# EAGLE design esp32_LedTube (EAGLE 9.6.2)
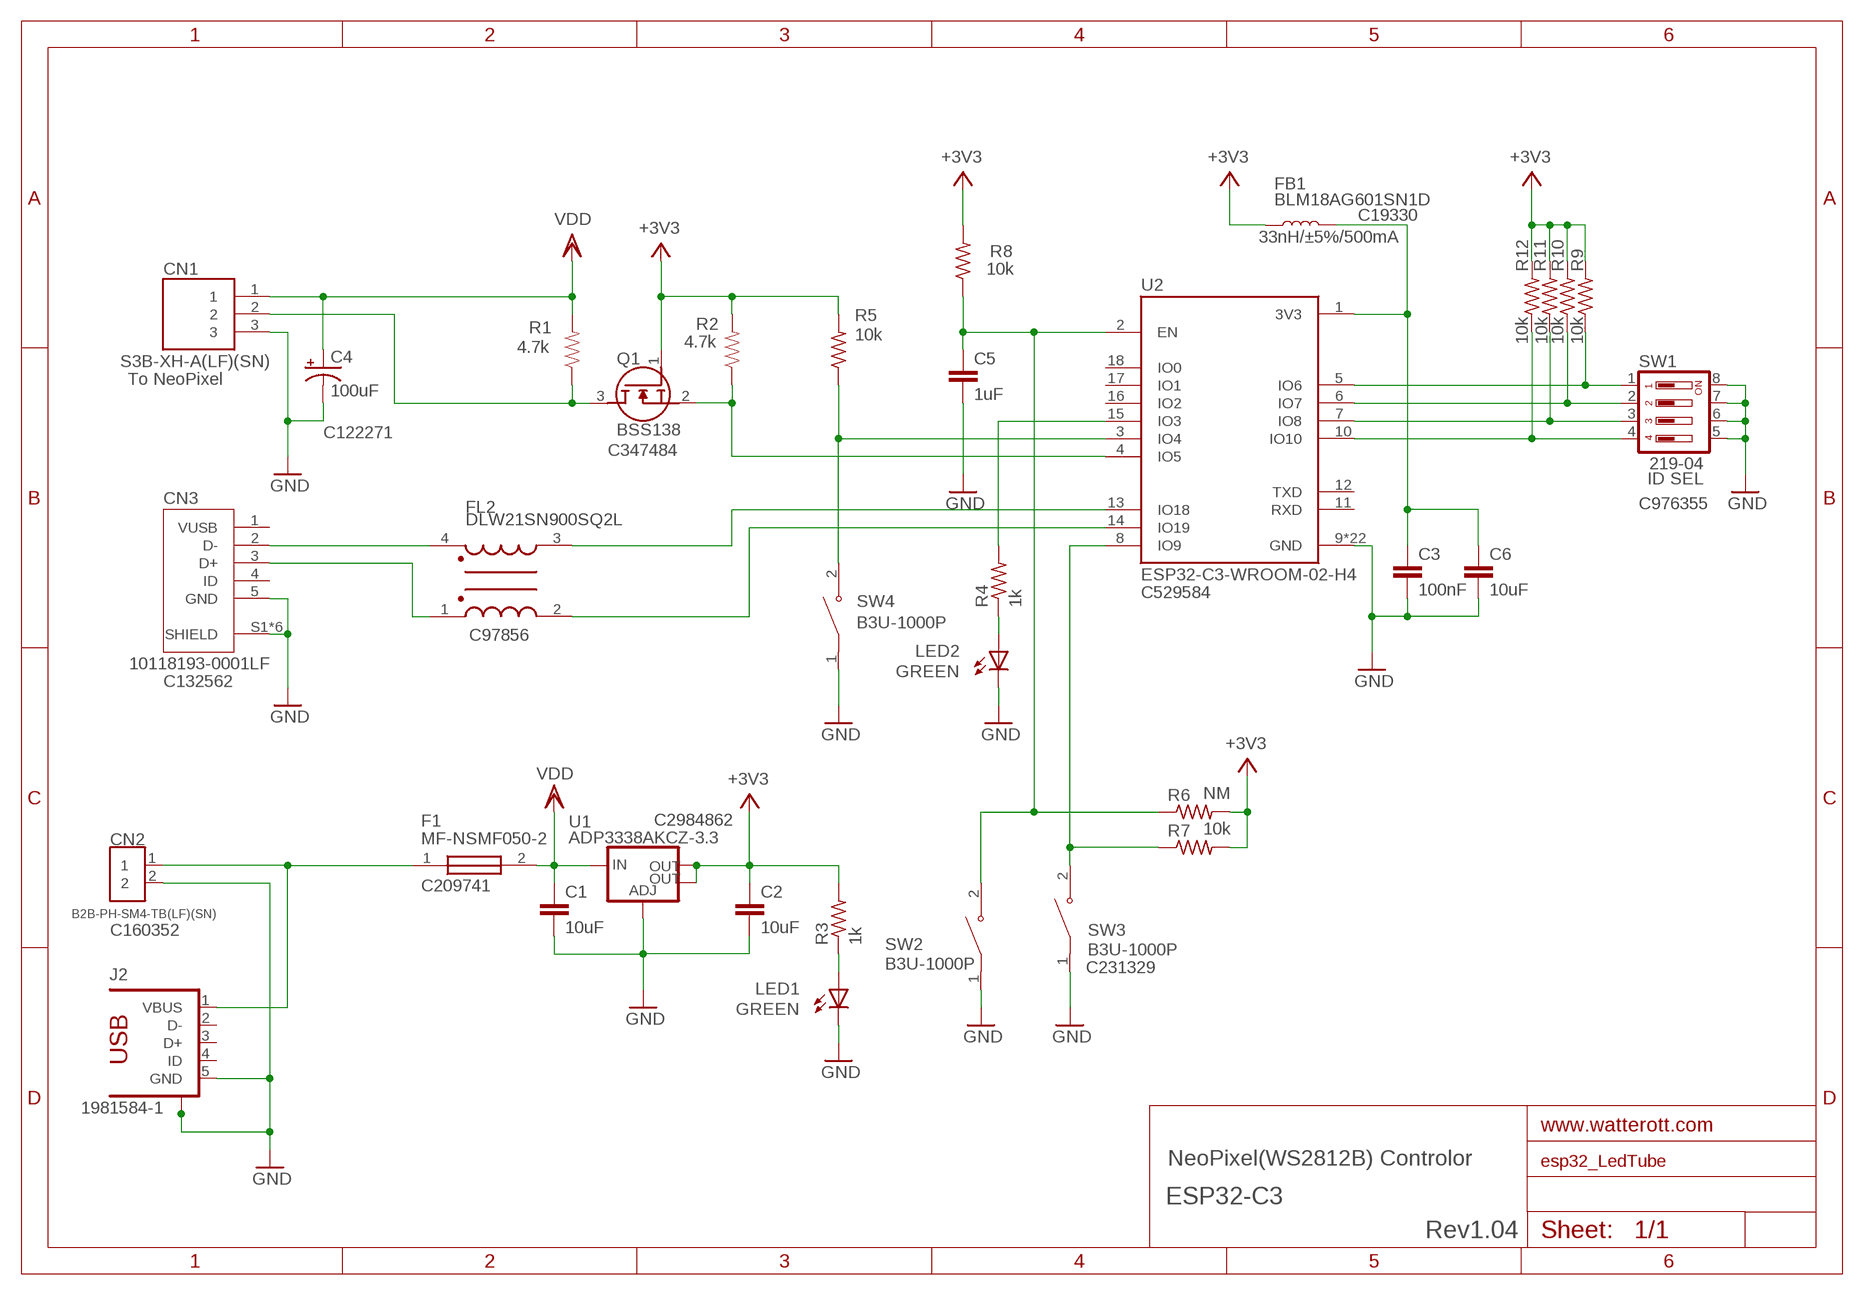
[diagram p0: schematic, sheet 1]

## Parts
C1  10uF  C-EUC0603  [C0603]
C2  10uF  C-EUC0603  [C0603]
C3  100nF  C-EUC0603  [C0603]
C4  100uF  CPOL-USB/3528-21R  [B/3528-21R]
C5  1uF  C-EUC0603  [C0603]
C6  10uF  C-EUC0603  [C0603]
CN1  S3B-XH-A(LF)(SN)  [JST_S3B-XH-A(LF)(SN)]
CN2  B2B-PH-SM4-TB(LF)(SN)  [JST_B2B-PH-SM4-TB(LF)(SN)]
CN3  10118193-0001LF  [FCI_10118193-0001LF]
F1  MF-NSMF050-2  [FUSC3216X85N]
FB1  33nH/±5%/500mA  INDUCTOR-0603-33NH  [0603]
FL2  DLW21SN900SQ2L  [FIL_DLW21SN900SQ2L]
J2  1981584-1  [1981584-1]
LED1  GREEN  LEDCHIPLED_0603  [CHIPLED_0603]
LED2  GREEN  LEDCHIPLED_0603  [CHIPLED_0603]
Q1  BSS138  [SOT95P240X120-3N]
R1  4.7k  750OHM-0603-1/10W-1%  [0603]
R2  4.7k  750OHM-0603-1/10W-1%  [0603]
R3  1k  R-US_R0603  [R0603]
R4  1k  R-US_R0603  [R0603]
R5  10k  R-US_R0603  [R0603]
R6  NM  R-US_R0603  [R0603]
R7  10k  R-US_R0603  [R0603]
R8  10k  R-US_R0603  [R0603]
R9  10k  R-US_R0603  [R0603]
R10  10k  R-US_R0603  [R0603]
R11  10k  R-US_R0603  [R0603]
R12  10k  R-US_R0603  [R0603]
SW1  219-04  [CTS-219-04]
SW2  B3U-1000P  [SW_B3U-1000P]
SW3  B3U-1000P  [SW_B3U-1000P]
SW4  B3U-1000P  [SW_B3U-1000P]
U1  ADP3338AKCZ-3.3  V_REG_LM1117SOT223  [SOT223]
U2  ESP32-C3-WROOM-02-H4  [MODULE_ESP32-C3-WROOM-02-H4]

## Nets
+3V3 [Power]: C2.1 FB1.1 Q1.1(G) R2.2 R3.2 R5.2 R6.2 R7.2 R8.2 R9.2 R10.2 R11.2 R12.2 U1.2(OUT) U1.4(OUT)
GND: C1.2 C2.2 C3.2 C4.- C5.2 C6.2 CN1.3 CN2.2 CN3.5(GND) CN3.S1(SHIELD) CN3.S2(SHIELD) CN3.S3(SHIELD) CN3.S4(SHIELD) CN3.S5(SHIELD) CN3.S6(SHIELD) J2.5(GND) J2.S1 J2.S2 J2.S3 J2.S4 LED1.C LED2.C SW1.5 SW1.6 SW1.7 SW1.8 SW2.1 SW3.1 SW4.1 U1.1(ADJ) U2.9(GND) U2.19(GND) U2.20(GND) U2.21(GND) U2.22(GND) U2.23(GND) U2.24(GND) U2.25(GND) U2.26(GND) U2.27(GND) U2.28(GND) U2.29(GND) U2.30(GND) U2.31(GND) U2.32(GND) U2.33(GND) U2.34(GND) U2.35(GND) U2.36(GND) U2.37(GND) U2.38(GND) U2.39(GND)
IO4: R9.1 SW1.1 U2.5(IO6)
IO12: R10.1 SW1.2 U2.6(IO7)
IO13: R11.1 SW1.3 U2.7(IO8)
IO14: R12.1 SW1.4 U2.10(IO10)
N$1: CN1.2 Q1.3(D) R1.1
N$2: LED2.A R4.1
N$3: FL2.3 U2.13(IO18)
N$4: R5.1 SW4.2 U2.3(IO4)
N$5: CN2.1 F1.1 J2.1(VBUS)
N$6: CN3.2(D-) FL2.4
N$8: CN3.3(D+) FL2.1
N$10: FL2.2 U2.14(IO19)
N$13: R4.2 U2.15(IO3)
N$15: LED1.A R3.1
N$17: R7.1 SW3.2 U2.8(IO9)
N$23: C3.1 C6.1 FB1.2 U2.1(3V3)
RST: C5.1 R6.1 R8.1 SW2.2 U2.2(EN)
SCL_18: Q1.2(S) R2.1 U2.4(IO5)
VDD: C1.1 C4.+ CN1.1 F1.2 R1.2 U1.3(IN)
Unconnected: CN3.1(VUSB) CN3.4(ID) J2.2(D-) J2.3(D+) J2.4(ID) U2.11(RXD) U2.12(TXD) U2.16(IO2) U2.17(IO1) U2.18(IO0)

## Notes on the sheet
- BLM18AG601SN1D
- C19330
- To NeoPixel
- C122271
- C347484
- ID SEL
- C976355
- C529584
- C97856
- C132562
- C2984862
- C209741
- C160352
- C231329
- NeoPixel(WS2812B) Controlor
- ESP32-C3
- Rev1.04

## Library data of the parts
C1-C3 C5 C6 = resistor:C-EU: CAPACITOR, European symbol
C4 = rcl:CPOL-US: POLARIZED CAPACITOR, American symbol; SPICEPREFIX: C
CN1 = S3B-XH-A_LF__SN_:S3B-XH-A(LF)(SN): Connector Header Through Hole, Right Angle 3 position 0.098" (2.50mm) Check availability <https://pricing.snapeda.com/parts/S3B-XH-A%20%28LF%29%28SN%29/JST/view-part?ref=eda>; AVAILABILITY: In Stock; DESCRIPTION: CONN, R/A HEADER, 3POS, 1ROW, 2.5MM; Connector Systems:Wire-to-Board; Pitch Spacing:2.5mm; No. of Rows:1Rows; No. of Contacts:3Contacts; Contact Termination Type:Through Hole Right Angle; Product Range:XH Series RoHS Compliant: Yes; MF: JST; MP: S3B-XH-A (LF)(SN); PACKAGE: None; PRICE: None; PURCHASE-URL: https://pricing.snapeda.com/search/part/S3B-XH-A (LF)(SN)/?ref=eda
CN2 = B2B-PH-SM4-TB_LF__SN_:B2B-PH-SM4-TB(LF)(SN): PH Series 2 Position 2 mm Pitch Surface Mount Top Entry Shrouded Header; DESCRIPTION: Connector Header Surface Mount 2 position 0.079 _2.00mm_; DIGI-KEY_PART_NUMBER: 455-1734-1-ND; DIGI-KEY_PURCHASE_URL: https://www.digikey.jp/product-detail/en/jst-sales-america-inc/B2B-PH-SM4-TB_LF__SN_/455-1734-1-ND/926831?utm_source=snapeda&utm_medium=aggregator&utm_campaign=symbol; MF: JST Sales; MP: B2B-PH-SM4-TB_LF__SN_; PACKAGE: None
CN3 = 10118193-0001LF:10118193-0001LF: Micro USB B Type Receptacle Check availability <https://pricing.snapeda.com/parts/10118193-0001LF/FCI/view-part?ref=eda>; AVAILABILITY: In Stock; DESCRIPTION: USB - micro B USB 2.0 Receptacle Connector 5 Position Surface Mount, Right Angle; Through Hole; MF: FCI; MP: 10118193-0001LF; PACKAGE: None; PRICE: None
F1 = MF-NSMF050-2:MF-NSMF050-2: Bourns 0.5A Surface Mount Resettable Fuse, 13.2V Source: Datasheet <https://componentsearchengine.com/Datasheets/2/MF-NSMF050-2.pdf>; DESCRIPTION: Bourns 0.5A Surface Mount Resettable Fuse, 13.2V; HEIGHT: 0.85mm; MANUFACTURER_NAME: Bourns; MANUFACTURER_PART_NUMBER: MF-NSMF050-2; MOUSER_PART_NUMBER: 652-MF-NSMF050-2; MOUSER_PRICE-STOCK: https://www.mouser.co.uk/ProductDetail/Bourns/MF-NSMF050-2?qs=sp2SQcijSb%252B%2FRFTS0mqFfg%3D%3D
FB1 = SparkFun-Coils:INDUCTOR: Inductors Resist changes in electrical current. Basically a coil of wire. SparkFun Products: SparkFun Load Cell Amplifier - HX711 <https://www.sparkfun.com/products/13879> IOIO-OTG - V2.2 <https://www.sparkfun.com/products/13613>; PROD_ID: NDUC-07874
FL2 = DLW21SN900SQ2L:DLW21SN900SQ2L: Check availability <https://pricing.snapeda.com/parts/DLW21SN900SQ2L/Murata/view-part?ref=eda>; AVAILABILITY: In Stock; DESCRIPTION: 2 Line Common Mode Choke Surface Mount 90 Ohms @ 100 MHz 330mA DCR 350mOhm; MF: Murata; MP: DLW21SN900SQ2L; PACKAGE: Horizontal-4 Murata; PRICE: None; PURCHASE-URL: https://pricing.snapeda.com/search/part/DLW21SN900SQ2L/?ref=eda
J2 = con-usb:1981584-1: Receptacle, micro-USB, type A/B Tyco Electronics; MF: Hirose; MPN: ZX62-AB-5PA(11)
LED1 LED2 = adafruit:LED: LED OSRAM: - CHIPLED LG R971, LG N971, LY N971, LG Q971, LY Q971, LO R971, LY R971 LH N974, LH R974 LS Q976, LO Q976, LY Q976 LO Q996 - Hyper CHIPLED LW Q18S LB Q993, LB Q99A, LB R99A - SideLED LS A670, LO A670, LY A670, LG A670, LP A670 LB A673, LV A673, LT A673, LW A673 LH A674 LY A675 LS A676, LA A676, LO A676, LY A676, LW A676 LS A679, LY A679, LG A679 - Hyper Micro SIDELED® LS Y876, LA Y876, LO Y876, LY Y876 LT Y87S - SmartLED LW L88C, LW L88S LB L89C, LB L89S, LG L890 LS L89K, LO L89K, LY L89K LS L896, LA L896, LO L896, LY L896 - TOPLED LS T670, LO T670, LY T670, LG T670, LP T670 LSG T670, LSP T670, LSY T670, LOP T670, LYG T670 LG T671, LOG T671, LSG T671 LB T673, LV T673, LT T673, LW T673 LH T674 LS T676, LA T676, LO T676, LY T676, LB T676, LH T676, LSB T676, LW T676 LB T67C, LV T67C, LT T67C, LS T67K, LO T67K, LY T67K, LW E67C LS E67B, LA E67B, LO E67B, LY E67B, LB E67C, LV E67C, LT E67C LW T67C LS T679, LY T679, LG T679 LS T770, LO T770, LY T770, LG T770, LP T770 LB T773, LV T773, LT T773, LW T773 LH T774 LS E675, LA E675, LY E675, LS T675 LS T776, LA T776, LO T776, LY T776, LB T776 LHGB T686 LT T68C, LB T68C - Hyper Mini TOPLED® LB M676 - Mini TOPLED Santana® LG M470 LS M47K, LO M47K, LY M47K Source: http://www.osram.convergy.de/
Q1 = SamacSys_Parts:BSS138: N-channel MOSFET,BSS138 0.2A 50V Source: Datasheet <https://www.onsemi.com/pub/Collateral/BSS138-D.PDF>; DESCRIPTION: N-channel MOSFET,BSS138 0.2A 50V; HEIGHT: 1.2mm; MANUFACTURER_NAME: ON Semiconductor; MANUFACTURER_PART_NUMBER: BSS138; MOUSER_PART_NUMBER: 512-BSS138; MOUSER_PRICE-STOCK: https://www.mouser.co.uk/ProductDetail/ON-Semiconductor-Fairchild/BSS138?qs=HK%252BeIG1iaahCeqBvjB4arg%3D%3D
R1 R2 = SparkFun-Resistors:750OHM: 750Ω resistor A resistor is a passive two-terminal electrical component that implements electrical resistance as a circuit element. Resistors act to reduce current flow, and, at the same time, act to lower voltage levels within circuits. - Wikipedia; PROD_ID: RES-07824; VALUE: 750
R3-R12 = resistor:R-US_: RESISTOR, American symbol
SW1 = switch-dil:219-04*: Surface Mount DIP Switch Series 219 SMT CTS Electronic Components Sourc: www.ctscorp.com; OC_FARNELL: unknown; OC_NEWARK: unknown
SW2-SW4 = B3U-1000P:B3U-1000P: Switch Tactile N.O. SPST Round Button Gull Wing 0.05A 12VDC 1.5N SMD Embossed T/R Check prices <https://pricing.snapeda.com/parts/B3U-1000P/Omron/view-part?ref=eda>; AVAILABILITY: In Stock; DESCRIPTION: Tactile Switch SPST-NO Top Actuated Surface Mount; MF: Omron; MP: B3U-1000P; PACKAGE: Custom Package Omron; PRICE: None; PURCHASE-URL: https://pricing.snapeda.com/search/part/B3U-1000P/?ref=eda
U1 = SparkFun-PowerIC:V_REG_LM1117: Voltage Regulator LM1117 Standard adjustable voltage regulator but in SMD form. Spark Fun Electronics SKU : COM-00595; PROD_ID: VREG-08170
U2 = ESP32-C3-WROOM-02-H4:ESP32-C3-WROOM-02-H4: WiFi Modules (802.11) (Engineering Samples) SMD module, ESP32-C3, 4MB SPI flash, PCB antenna, -40 C +105 C Check availability <https://pricing.snapeda.com/parts/ESP32-C3-WROOM-02-H4/Espressif%20Systems/view-part?ref=eda> Check availability <https://pricing.snapeda.com/parts/ESP32-C3-WROOM-02-H4/Espressif%20Systems/view-part?ref=eda> Check availability <https://pricing.snapeda.com/parts/ESP32-C3-WROOM-02-H4/Espressif%20Systems/view-part?ref=eda>; AVAILABILITY: In Stock; DESCRIPTION: WiFi Modules (802.11) (Engineering Samples) SMD module, ESP32-C3, 4MB SPI flash, PCB antenna, -40 C +105 C; MF: Espressif Systems; MP: ESP32-C3-WROOM-02-H4; PACKAGE: Package; PRICE: None; PURCHASE-URL: https://pricing.snapeda.com/search/part/ESP32-C3-WROOM-02-H4/?ref=eda

## Net classes
1 Power: width 0.305 mm

## Board
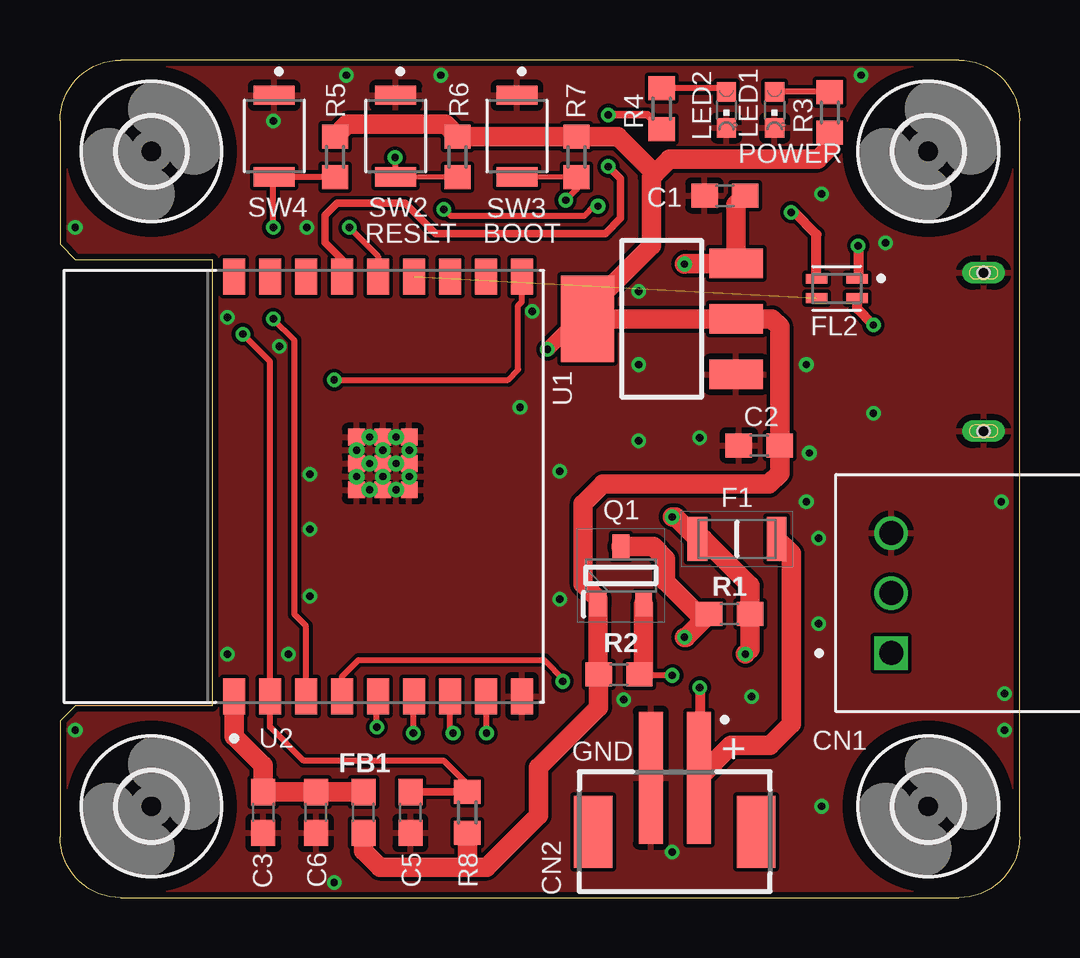
[diagram p1: board, top side]
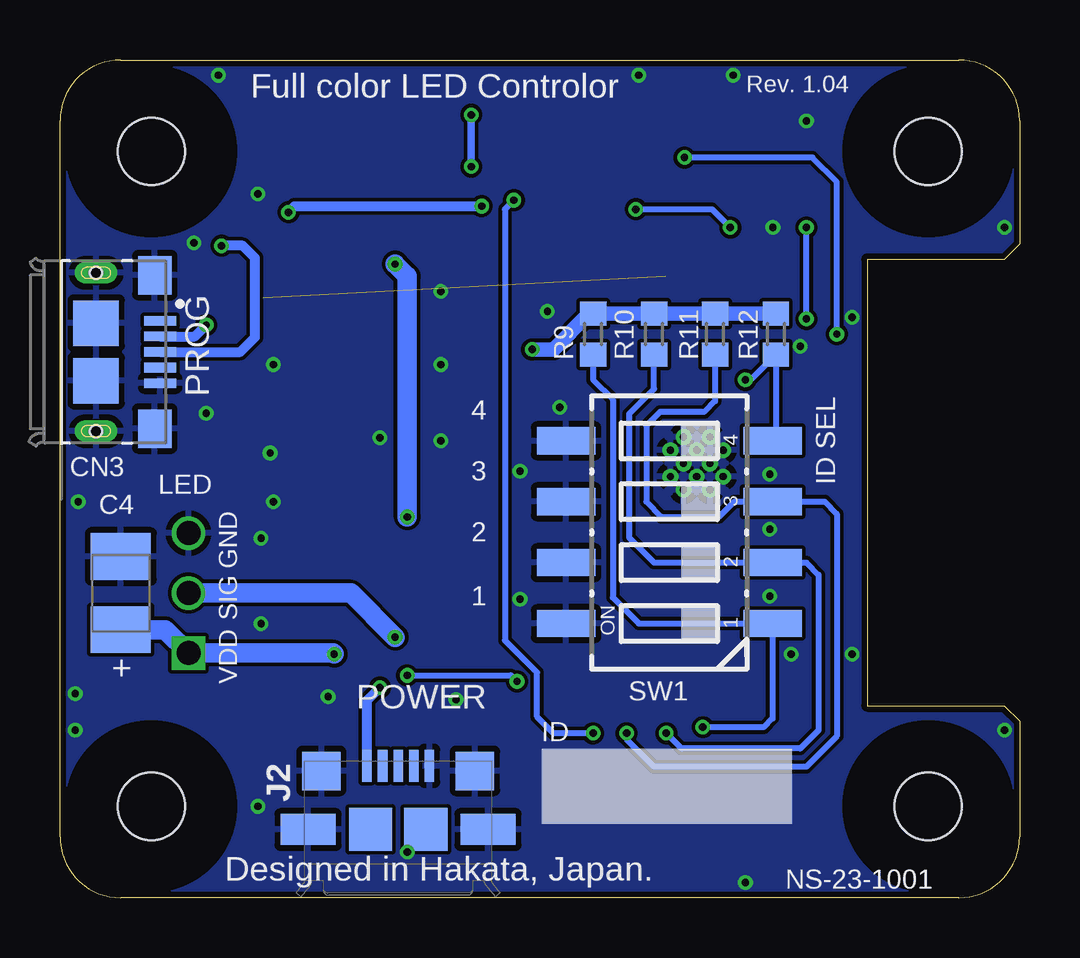
[diagram p2: board, bottom side, seen from below]

Size 40.01 x 34.92 mm. Coordinates in mm from the lower left corner, seen from the top.
Outline: 2.54,0 arc-90 0,2.54 0,7.37 0.64,8 6.35,8 6.35,26.61 0.64,26.61 0,27.24 0,32.38 arc-90 2.54,34.92 37.47,34.92 arc-90 40.01,32.38 40.01,2.54 arc-90 37.47,0 2.54,0
Copper layers (1*16): Top 0.035mm / dielectric 1.5mm / Bottom 0.035mm
Design rules "SeeedStudio_2layer_DRU_no_angle_20140221": minimum track width 6mil, minimum drill 12mil, track to track 6mil, track to pad 6mil, pad to pad 6mil, via to via 6mil, smd to smd 0mil, copper to edge 10mil, drill to drill 10mil, minimum pad ring 7mil, minimum via ring 6mil, stop-mask expansion 2mil, vias tented up to drill 100mil, thermal gap 10mil

### Footprints (pad centres in the part's own frame; a part is rotated, then mirrored left to right if it is on the bottom)
C0603 = smd 1.1 x 1: 1 -0.85,0; 2 0.85,0
B/3528-21R = smd 1.95 x 2.5: + 1.525,0; - -1.525,0
JST_S3B-XH-A(LF)(SN) = drill 1 square: 1 2.5,-3.45 | drill 1: 2 0,-3.45; 3 -2.5,-3.45
JST_B2B-PH-SM4-TB(LF)(SN) = smd 1 x 5.5: 1 -1,0; 2 1,0 | smd 1.6 x 3: 3 -3.4,2.25; 4 3.4,2.25
FCI_10118193-0001LF = smd 0.4 x 1.35: 1 -1.3,2.675; 2 -0.65,2.675; 3 0,2.675; 4 0.65,2.675; 5 1.3,2.675 | smd 1.6 x 1.4: S1 -3.2,2.45; S2 3.2,2.45 | smd 1.9 x 1.9: S3 1.2,0; S4 -1.2,0 | drill 0.5 pad 0.9 long: S5 -3.3,0; S6 3.3,0 | hole 0.5: -3.3,0; 3.3,0
FUSC3216X85N = smd 0.82 x 1.82: 1 -1.65,0; 2 1.65,0
0603 = smd 1.1 x 1: 1 -0.85,0; 2 0.85,0
FIL_DLW21SN900SQ2L = smd 0.9 x 0.4: 1 -0.85,-0.4; 2 0.85,-0.4; 3 0.85,0.4; 4 -0.85,0.4
1981584-1 = smd 0.4 x 1.35: 1 -1.3,4.1; 2 -0.65,4.1; 3 0,4.1; 4 0.65,4.1; 5 1.3,4.1 | smd 1.8 x 1.8: M1 -1.15,1.45; M2 1.15,1.45 | smd 2.3 x 1.3: S1 -3.75,1.45; S2 3.75,1.45 | smd 1.6 x 1.6: S3 -3.2,3.885; S4 3.2,3.885
CHIPLED_0603 = smd 0.8 x 0.8: A 0,-0.75; C 0,0.75
SOT95P240X120-3N = smd 1 x 0.7: 1 -1.2,0.95; 2 -1.2,-0.95; 3 1.2,0
R0603 = smd 1 x 1.1: 1 -0.85,0; 2 0.85,0
CTS-219-04 = smd 1.13 x 2.44: 1 -3.81,-4.3; 2 -1.27,-4.3; 3 1.27,-4.3; 4 3.81,-4.3; 5 3.81,4.3; 6 1.27,4.3; 7 -1.27,4.3; 8 -3.81,4.3
SW_B3U-1000P = smd 0.8 x 1.7: 1 -1.7,0; 2 1.7,0
SOT223 = smd 1.219 x 2.235: 1 -2.311,-3.099; 2 0,-3.099; 3 2.311,-3.099 | smd 3.6 x 2.2: 4 0,3.099
MODULE_ESP32-C3-WROOM-02-H4 = smd 1.5 x 0.9: 1 -8.75,2.9; 2 -8.75,1.4; 3 -8.75,-0.1; 4 -8.75,-1.6; 5 -8.75,-3.1; 6 -8.75,-4.6; 7 -8.75,-6.1; 8 -8.75,-7.6; 9 -8.75,-9.1; 10 8.75,-9.1; 11 8.75,-7.6; 12 8.75,-6.1; 13 8.75,-4.6; 14 8.75,-3.1; 15 8.75,-1.6; 16 8.75,-0.1; 17 8.75,1.4; 18 8.75,2.9 | smd 0.7 x 0.7: 19 -0.14,-2.2; 20 0.96,-2.2; 21 2.06,-2.2; 22 -0.14,-3.3; 23 0.96,-3.3; 24 2.06,-3.3; 25 -0.14,-4.4; 26 0.96,-4.4; 27 2.06,-4.4 | drill 0.3 pad 0.4: 28 0.41,-2.2; 29 1.51,-2.2; 30 -0.14,-2.75; 31 0.96,-2.75; 32 2.06,-2.75; 33 0.41,-3.3; 34 1.51,-3.3; 35 -0.14,-3.85; 36 0.96,-3.85; 37 2.06,-3.85; 38 0.41,-4.4; 39 1.51,-4.4
2,8 = hole 2.8: 0,0

### Placement (x,y rotation side)
C1  27.72,29.27 180 top
C2  29.15,18.86 180 top
C3  8.47,3.56 270 top
C4  37.47,12.7 270 bottom
C5  14.61,3.56 270 top
C6  10.67,3.56 270 top
CN1  38.1,12.7 270 top
CN2  25.63,5 180 top
CN3  38.5,22.75 270 bottom
F1  28.22,14.95 180 top
FB1  12.65,3.56 90 top
FL2  32.38,25.4 180 top
J2  25.91,1.4 0 bottom
LED1  29.79,32.84 180 top
LED2  27.78,32.84 180 top
Q1  23.38,13.44 90 top
R1  27.91,11.82 0 top
R2  23.3,9.31 180 top
R3  32.09,32.74 270 top
R4  25.08,32.89 270 top
R5  11.47,30.89 90 top
R6  16.57,30.89 90 top
R7  21.53,30.89 90 top
R8  16.98,3.56 270 top
R9  17.78,23.49 90 bottom
R10  15.24,23.49 90 bottom
R11  12.7,23.49 90 bottom
R12  10.16,23.49 90 bottom
SW1  14.61,15.24 90 bottom
SW2  14,31.75 270 top
SW3  19.05,31.75 270 top
SW4  8.93,31.75 270 top
U1  25.08,24.13 90 top
U2  10.16,17.14 90 top
U$1  [2,8]  3.81,31.11 0 top
U$2  [2,8]  36.2,31.11 0 top
U$3  [2,8]  3.81,3.81 0 top
U$4  [2,8]  36.2,3.81 0 top

### Tracks (layer width: path | path; a pad name or v marks a point on that pad's centre or on a via)
+3V3  (via drill 0.3)
  Top 0.61: v20.32,22.86 21.59,24.13 U1.4
  Top 0.813: 24.8,30.19 24.65,30.05 24.65,27.18 21.98,24.51 U1.4 U1.2 29.69,24.13 30,23.81 C2.1 | 24.8,30.19 25.4,30.8 31.59,30.8 32.09,31.29 R3.2 | 24.8,30.19 23.25,31.74 R7.2 R6.2 16.07,32.24 11.98,32.24 R5.2 | FB1.1 12.65,1.96 13.34,1.27 17.14,1.27 | 17.14,1.27 17.78,1.27 19.94,3.43 19.94,5.43 22.45,7.94 R2.2 22.43,9.33 Q1.1 22.43,12.46 21.81,13.08 21.81,16.41 22.64,17.24 29.56,17.24 30,17.68 C2.1 | R8.2 16.98,1.44 17.14,1.27 | C2.1
  Bottom 0.61: R12.2 R11.2 R10.2 R9.2 17.95,24.34 19.43,22.86 v20.32,22.86
GND  (via drill 0.3)
  other vias: 0.64,27.94 0.64,6.99 11.43,0.64 25.53,1.91 31.75,3.81 28.83,8.38 39.37,6.99 39.37,8.51 31.62,11.43 31.62,14.99 23.5,8.25 9.53,10.16 6.99,10.16 39.24,16.51 31.11,16.51 31.24,18.54 20.83,12.45 20.83,17.78 19.18,20.45 10.41,12.57 10.41,15.37 10.41,17.65 6.99,24.19 19.68,24.45 24.13,19.05 26.67,19.18 33.91,20.19 24.13,22.22 24.13,25.27 34.42,27.3 31.75,29.34 10.29,27.94 8.89,32.38 11.94,34.29 15.88,34.29 33.4,34.29 9.14,22.99 31.11,22.22
  pour Top: 0,34.92 40.01,34.92 40.01,0 0,0
  pour Bottom (isolate 0.025): 0,34.92 40.01,34.92 40.01,-0.05 0,-0.05
IO4  (via drill 0.3)
  Top 0.254: v13.21,7.11 13.21,8.34 U2.5
  Bottom 0.254: R9.1 17.78,21.59 16.95,20.76 16.95,12.51 15.88,11.43 SW1.1 10.3,7.47 10.67,7.11 v13.21,7.11
IO12  (via drill 0.3)
  Top 0.254: v14.73,6.86 14.73,8.37 U2.6
  Bottom 0.254: R10.1 15.24,21.21 16.28,20.17 16.28,15.01 15.24,13.97 SW1.2 8.89,13.97 8.38,13.46 8.38,6.99 9.14,6.22 14.1,6.22 v14.73,6.86
IO13  (via drill 0.3)
  Top 0.254: v16.38,6.86 16.26,6.98 U2.7
  Bottom 0.254: R11.1 12.7,20.7 13.14,20.26 14.99,20.26 15.56,19.68 15.56,16.51 14.92,15.88 12.53,15.88 11.89,16.51 SW1.3 8.13,16.51 7.62,16 7.62,6.73 8.89,5.46 15.24,5.46 16.38,6.6 v16.38,6.86
IO14  (via drill 0.3)
  Top 0.254: v11.43,21.59 18.67,21.59 19.1,22.02 19.1,24.69 19.26,24.85 U2.10
  Bottom 0.254: SW1.4 10.16,19.2 R12.1 11.21,21.59 v11.43,21.59
N$1  (via drill 0.3)
  Top 0.813: Q1.3 24.73,14.64 25.24,14.13 25.24,13.18 26.59,11.82 R1.1 26.1,10.86 v26.04,10.86
  Bottom 0.813: v26.04,10.86 27.88,12.7 CN1.2
N$2
  Top 0.254: LED2.A 27.63,33.74 R4.1
N$3  (1 unrouted)
N$4  (via drill 0.3)
  Top 0.254: U2.3 10.26,11.33 9.78,11.81 9.78,23.24 v8.89,24.13 | v8.89,27.94 8.89,30.01 SW4.2 11.45,30.05 R5.1
  Bottom 0.254: v8.89,24.13 v8.89,27.94
N$5  (via drill 0.3)
  Top 0.406: v26.67,8.76 26.67,5.04 CN2.1
  Top 0.813: CN2.1 27.98,6.35 29.59,6.35 30.48,7.24 30.48,14.34 F1.1
  Bottom 0.406: J2.1 27.21,8.22 v26.67,8.76
N$6  (via drill 0.3)
  Top 0.406: v33.91,23.88 33.23,24.55 FL2.4
  Bottom 0.406: CN3.2 34.38,23.4 v33.91,23.88
N$8  (via drill 0.3)
  Top 0.406: v33.27,27.18 33.27,25.84 FL2.1
  Bottom 0.406: CN3.3 32.49,22.75 31.88,23.37 31.88,26.67 32.38,27.18 v33.27,27.18
N$10  (via drill 0.3)
  Top 0.254: v22.43,28.83 22.27,28.83 21.86,28.42 16.28,28.42 v16,28.7 | v12.06,27.94 13.26,26.74 U2.14
  Top 0.406: FL2.2 31.54,27.65 30.61,28.57 v30.48,28.57
  Bottom 0.254: v16,28.7 12.83,28.7 v12.06,27.94
  Bottom 0.406: v30.48,28.57 30.23,28.83 v22.43,28.83
N$13  (via drill 0.3)
  Top 0.305: U2.15 11.76,26.59 11.05,27.3 11.05,28.45 11.56,28.96 14.38,28.96 15.65,27.69 22.73,27.69 23.37,28.32 23.37,29.97 v22.86,30.48 | v22.86,32.64 24.49,32.64 R4.2
  Bottom 0.305: v22.86,30.48 v22.86,32.64
N$15
  Top 0.254: R3.1 LED1.A
N$17  (via drill 0.3)
  Top 0.203: SW3.2 21.52,30.05 R7.1
  Top 0.254: U2.8 17.76,6.88 v17.78,6.86 | R7.1 21.53,29.53 v21.08,29.08
  Bottom 0.254: v17.78,6.86 19.43,6.86 20.12,7.54 20.12,9.39 21.46,10.73 21.46,28.7 v21.08,29.08
N$23
  Top 0.813: U2.1 7.26,6.73 8.47,5.52 C3.1 C6.1 FB1.2
RST  (via drill 0.3)
  Top 0.203: SW2.2 R6.1
  Top 0.254: R8.1 16.98,4.74 16,5.71 10.16,5.71 8.76,7.12 U2.2 8.76,22.36 v7.62,23.49 | v13.97,30.86 13.97,30.07 SW2.2
  Top 0.305: C5.1 R8.1
  Bottom 0.254: v7.62,23.49 7.62,29.84 8.64,30.86 v13.97,30.86
SCL_18  (via drill 0.3)
  Top 0.254: U2.4 11.76,9.22 12.45,9.91 20.19,9.91 21.02,9.08 v20.95,9.02 | v25.53,9.27 24.55,9.27 24.33,9.48
  Top 0.813: Q1.2 24.33,9.48 R2.1
  Bottom 0.254: v20.95,9.02 21.21,9.27 v25.53,9.27
VDD  (via drill 0.3)
  Top 0.813: C1.1 28.18,28.89 U1.3 26.06,26.44 v26.04,26.42 | v25.53,15.88 25.65,15.88 F1.2 26.83,14.95 28.77,13.02 R1.2 28.77,10.35 v28.57,10.16
  Bottom 0.813: C4.+ 35.62,11.18 CN1.1 28.61,10.2 v28.57,10.16 | v25.53,15.88 25.53,25.91 v26.04,26.42

### Text on the board
tPlace: POWER | RESET | BOOT | GND | +
bPlace: Rev. 1.04 | Full color LED Controlor | PROG | ID SEL | 4 | 3 | LED | GND | 2 | SIG | 1 | VDD | + | POWER | ID | NS-23-1001 | Designed in Hakata, Japan.
201bmp: D:/users/Dropbox/Git/Eagle/hikari_come.bmp